# Altium schematic sheet GPIO.SchDoc
size A
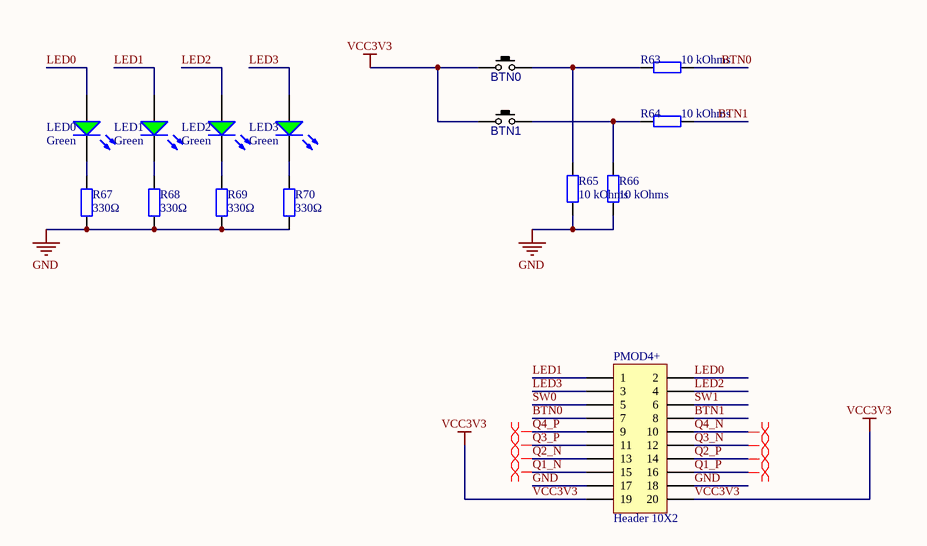
[diagram p0: GPIO.SchDoc]

## Parts
BTN0  PUSHBUTTON  [SWPBS_SPST_6X3X5]  (value not drawn)
BTN1  PUSHBUTTON  [SWPBS_SPST_6X3X5]  (value not drawn)
LED0  Green  [0805_LED_S1]
LED1  Green  [0805_LED_S1]
LED2  Green  [0805_LED_S1]
LED3  Green  [0805_LED_S1]
PMOD4+  Header 10X2  [HDR2X10]
R63  10 kOhms  [RES0402i]
R64  10 kOhms  [RES0402i]
R65  10 kOhms  [RES0402i]
R66  10 kOhms  [RES0402i]
R67  330Ω  [0805_R]
R68  330Ω  [0805_R]
R69  330Ω  [0805_R]
R70  330Ω  [0805_R]

## Nets
GND: PMOD4+.17 PMOD4+.18 R65.1 R66.1 R67.1 R68.1 R69.1 R70.1
VCC3V3: BTN0.1(P1) BTN1.1(P1) PMOD4+.19 PMOD4+.20
BTN0: PMOD4+.7 R63.2
BTN1: PMOD4+.8 R64.2
LED0: LED0.A PMOD4+.2
LED1: LED1.A PMOD4+.1
LED2: LED2.A PMOD4+.4
LED3: LED3.A PMOD4+.3
Q1_N: PMOD4+.15
Q1_P: PMOD4+.16
Q2_N: PMOD4+.13
Q2_P: PMOD4+.14
Q3_N: PMOD4+.12
Q3_P: PMOD4+.11
Q4_N: PMOD4+.10
Q4_P: PMOD4+.9
SW0: PMOD4+.5
SW1: PMOD4+.6
NetBTN0_2: BTN0.2(P3) R63.1 R65.2
NetBTN1_2: BTN1.2(P3) R64.1 R66.2
NetLED0_K: LED0.K R67.2
NetLED1_K: LED1.K R68.2
NetLED2_K: LED2.K R69.2
NetLED3_K: LED3.K R70.2

## Layout directives
differential pair: Q1_N, Q1_P, Q2_N, Q2_P, Q3_N, Q3_P, Q4_N, Q4_P

## Library data of the parts
BTN0 BTN1 = SWPBS_SPST_6X3X4: SWITCH, PUSH BUTTON, TACTILE, SMD, SPST, 6X3.5X4.3mm; MANF: Panasonic; DESC: DESCRIPTION; MANF_P#: EVQ-PNF04M; VALUE: PUSHBUTTON; ASSEMBLY: ASSEMBLY; PARAM: PARAM; PRICE: PRICE
LED0-LED3 = 0805 翠绿: 发光二极管; ComponentLink1Description: 供应商链接; ComponentLink1URL: http://www.szlcsc.com/product/details_2670.html; Package: 0805; Supplier: LC; SuppliersPartNumber: C2297
PMOD4+ = Header 10X2: Header, 10-Pin, Dual row; LatestRevisionDate: 17-Jul-2002; LatestRevisionNote: Re-released for DXP Platform.; Publisher: Altium Limited
R63-R66 = Res_10k_1%_0402: 0402, 10K 1%,  62.5mW, 50V; Part Number: CR0402-FX-1002GLF; Manufacturer 1: Bourns; Temperature Coefficient: 100 PPM / C; Value: 10k, 1%,  62.5mW, 50V; Package: 0402 (1005 Metric); Voltage: 50V; Tolerance: ±1%; Operating Temperature: -55°C ~ 125°C; Mounting Type: SMT; Supplier 1: Mouser; Supplier Part Number 1: 652-CR0402FX-1002GLF; Manufacturer Part Number 1: CR0402-FX-1002GLF; Component Type: Generic; Resistance: 10 kOhms; Note: *; Supplier 2: DigiKey; Supplier 3: Farnell; Supplier Part Number 2: CR0402-FX-1002GLFCT-ND; Supplier Part Number 3: 2333566
R67-R70 = 0805 330Ω (3300) 1%: 贴片电阻; ComponentLink1Description: 供应商链接; ComponentLink1URL: http://www.szlcsc.com/product/details_18318.html; Package: 0805; Supplier: LC; SuppliersPartNumber: C17630